# Altium schematic sheet BV100011_ControlDO.SchDoc
size A3
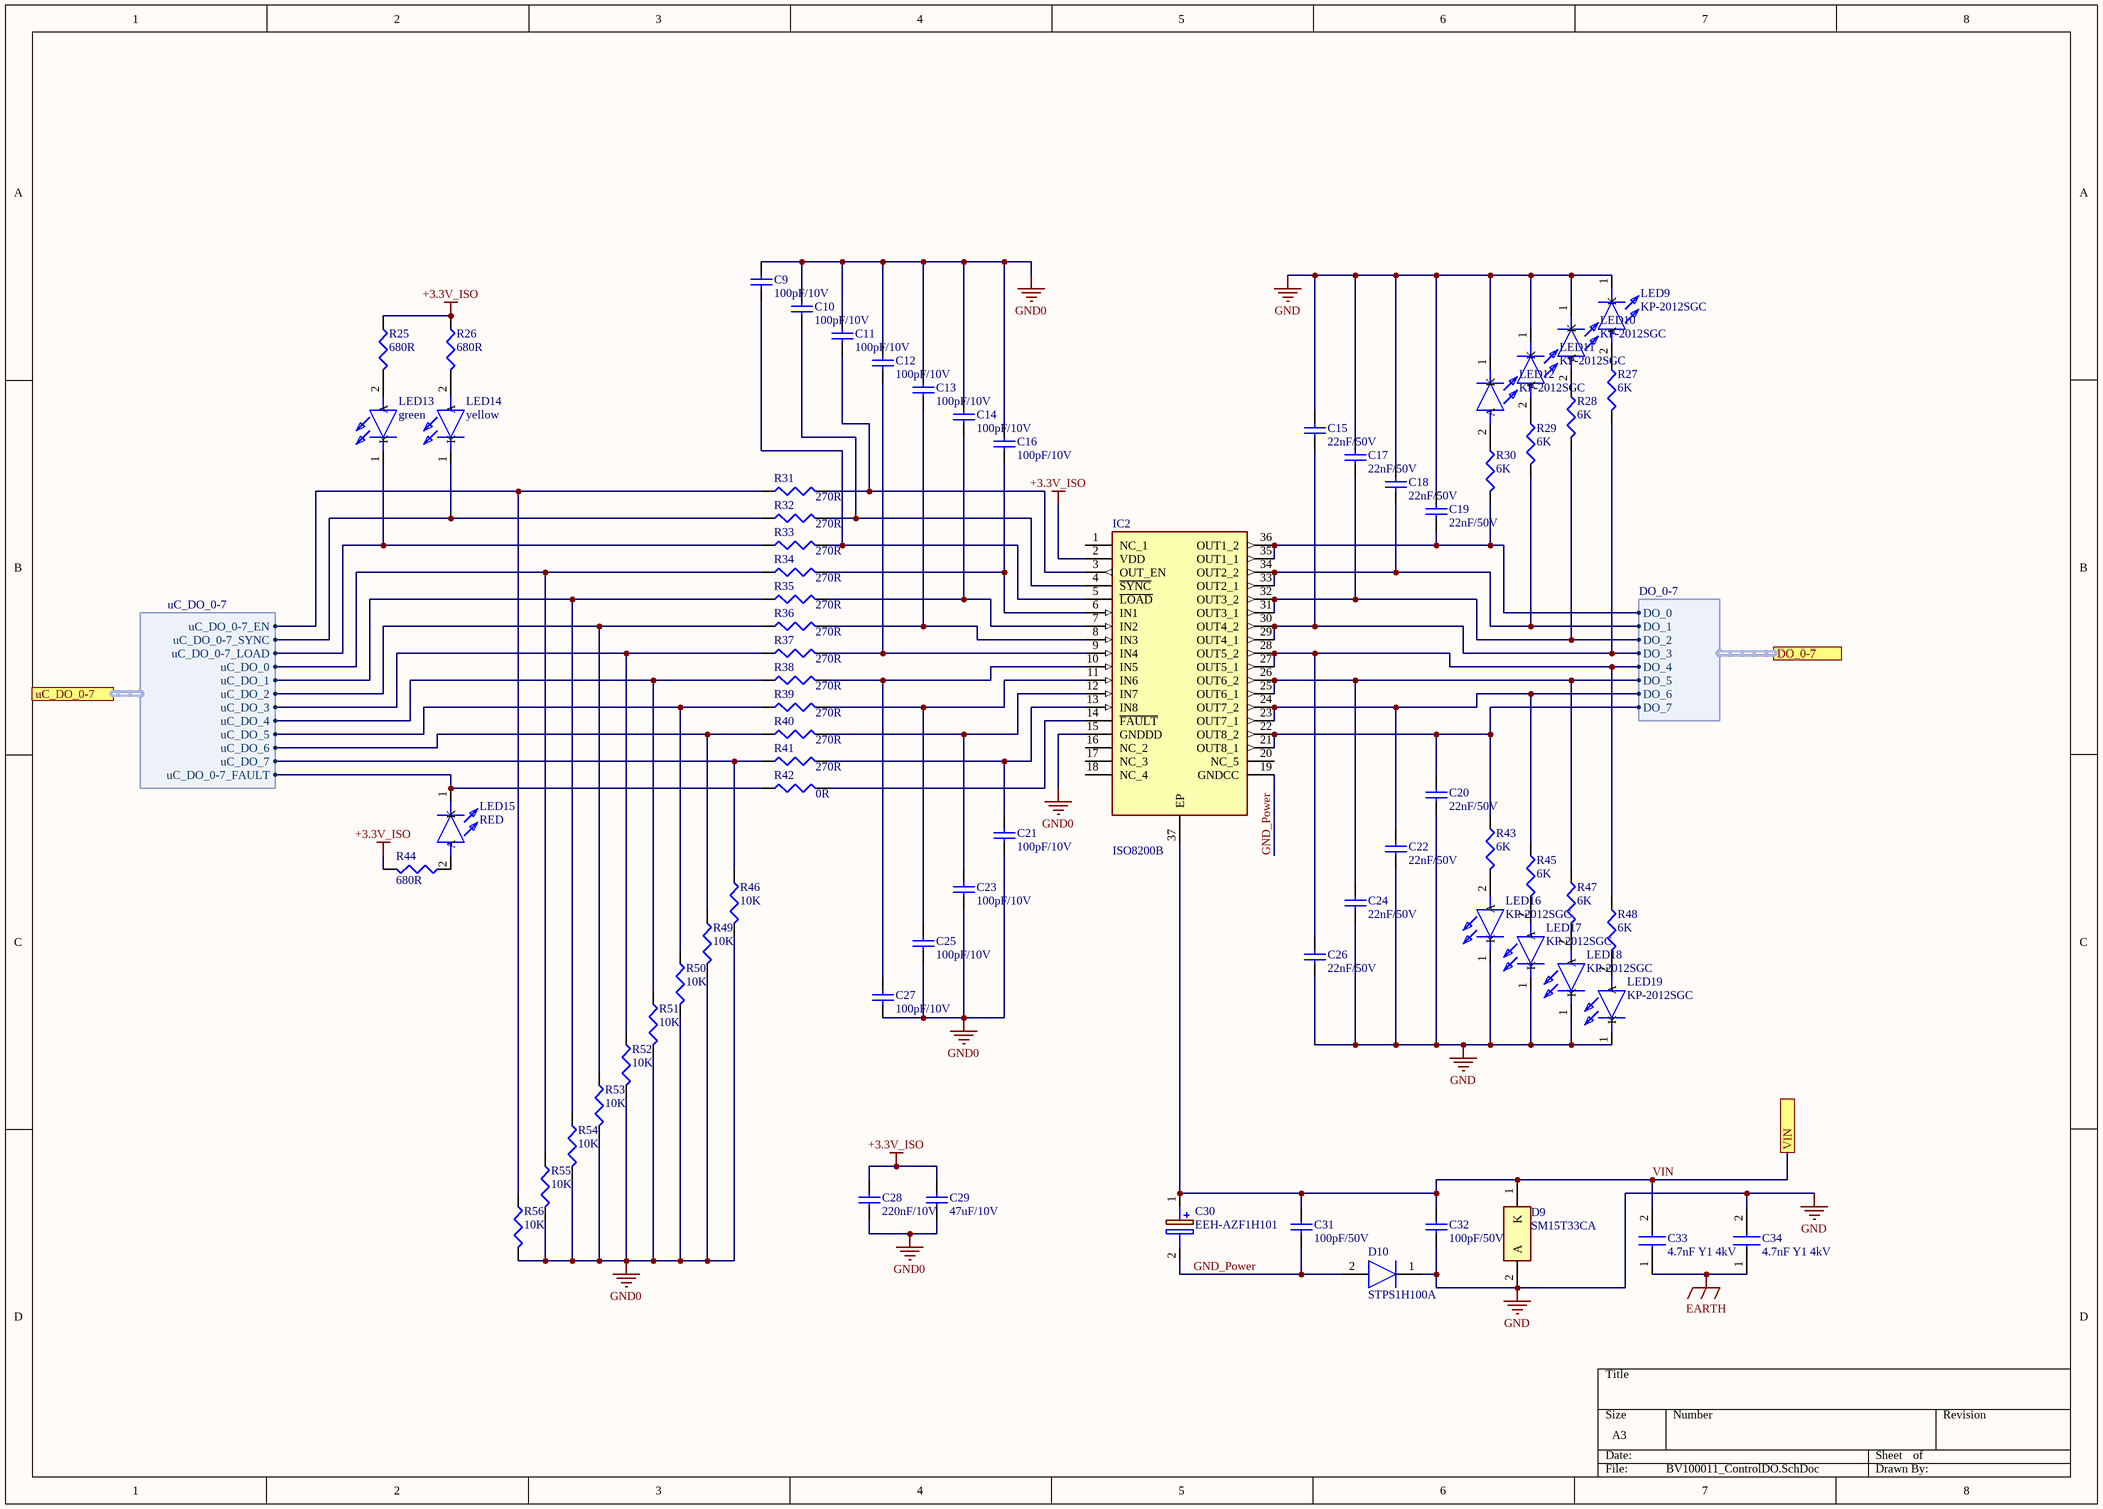
[diagram p0: BV100011_ControlDO.SchDoc]

## Parts
C9  100pF/10V  [0402]
C10  100pF/10V  [0402]
C11  100pF/10V  [0402]
C12  100pF/10V  [0402]
C13  100pF/10V  [0402]
C14  100pF/10V  [0402]
C15  22nF/50V  [C1210]
C16  100pF/10V  [0402]
C17  22nF/50V  [C1210]
C18  22nF/50V  [C1210]
C19  22nF/50V  [C1210]
C20  22nF/50V  [C1210]
C21  100pF/10V  [0402]
C22  22nF/50V  [C1210]
C23  100pF/10V  [0402]
C24  22nF/50V  [C1210]
C25  100pF/10V  [0402]
C26  22nF/50V  [C1210]
C27  100pF/10V  [0402]
C28  220nF/10V  [C1210]
C29  47uF/10V  [C1210]
C30  EEH-AZF1H101  [CAPPRD500W65D1000H1050]
C31  100pF/50V  [C1210]
C32  100pF/50V  [C1210]
C33  4.7nF Y1 4kV  [VY1472M63Y5UQ63V0]
C34  4.7nF Y1 4kV  [VY1472M63Y5UQ63V0]
D9  SM15T33CA  [DIONM8059X265N]
D10  STPS1H100A  [DIOM5126X265N]
IC2  ISO8200B  [SOP65P1420X360-37N]
LED9  KP-2012SGC  [LEDC2012X110N]
LED10  KP-2012SGC  [LEDC2012X110N]
LED11  KP-2012SGC  [LEDC2012X110N]
LED12  KP-2012SGC  [LEDC2012X110N]
LED13  green  [LEDC2012X110N]
LED14  yellow  [LEDC2012X110N]
LED15  RED  [LEDC2012X110N]
LED16  KP-2012SGC  [LEDC2012X110N]
LED17  KP-2012SGC  [LEDC2012X110N]
LED18  KP-2012SGC  [LEDC2012X110N]
LED19  KP-2012SGC  [LEDC2012X110N]
R25  680R  [0402]
R26  680R  [0402]
R27  6K  [0805R]
R28  6K  [0805R]
R29  6K  [0805R]
R30  6K  [0805R]
R31  270R  [0402]
R32  270R  [0402]
R33  270R  [0402]
R34  270R  [0402]
R35  270R  [0402]
R36  270R  [0402]
R37  270R  [0402]
R38  270R  [0402]
R39  270R  [0402]
R40  270R  [0402]
R41  270R  [0402]
R42  0R  [0402]
R43  6K  [0805R]
R44  680R  [0402]
R45  6K  [0805R]
R46  10K  [0402]
R47  6K  [0805R]
R48  6K  [0805R]
R49  10K  [0402]
R50  10K  [0402]
R51  10K  [0402]
R52  10K  [0402]
R53  10K  [0402]
R54  10K  [0402]
R55  10K  [0402]
R56  10K  [0402]

## Ports
DO_0-7 (harness DO_0-7), uC_DO_0-7 (harness uC_DO_0-7), VIN

## Harnesses
DO_0-7: DO_0, DO_1, DO_2, DO_3, DO_4, DO_5, DO_6, DO_7
uC_DO_0-7: uC_DO_0-7_EN, uC_DO_0-7_SYNC, uC_DO_0-7_LOAD, uC_DO_0, uC_DO_1, uC_DO_2, uC_DO_3, uC_DO_4, uC_DO_5, uC_DO_6, uC_DO_7, uC_DO_0-7_FAULT

## Nets
+3.3V_ISO: C28.2 C29.2 IC2.2(VDD) R25.1 R26.1 R44.2
EARTH: C33.1 C34.1
GND: C15.1 C17.1 C18.1 C19.1 C20.2 C22.2 C24.2 C26.2 C32.1 C34.2 D9.2(A) D10.1(K) LED9.1(K) LED10.1(K) LED11.1(K) LED12.1(K) LED16.1(K) LED17.1(K) LED18.1(K) LED19.1(K)
GND0: C9.1 C10.1 C11.1 C12.1 C13.1 C14.1 C16.1 C21.2 C23.2 C25.2 C27.2 C28.1 C29.1 IC2.15(GNDDD) R46.2 R49.2 R50.2 R51.2 R52.2 R53.2 R54.2 R55.2 R56.2
GND_Power: C30.2(-) C31.1 D10.2(A) IC2.19(GNDCC)
VIN: C30.1(+) C31.2 C32.2 C33.2 D9.1(K) IC2.37(EP) ; port VIN
NetC9_2: C9.2 IC2.5(~{LOAD}) R33.2
NetC10_2: C10.2 IC2.4(~{SYNC}) R32.2
NetC11_2: C11.2 IC2.3(OUT_EN) R31.2
NetC12_2: C12.2 IC2.9(IN4) R37.2
NetC13_2: C13.2 IC2.8(IN3) R36.2
NetC14_2: C14.2 IC2.7(IN2) R35.2
NetC15_2: C15.2 IC2.29(OUT4_1) IC2.30(OUT4_2) R27.2 ; port DO_0-7.DO_3
NetC16_2: C16.2 IC2.6(IN1) R34.2
NetC17_2: C17.2 IC2.31(OUT3_1) IC2.32(OUT3_2) R28.2 ; port DO_0-7.DO_2
NetC18_2: C18.2 IC2.33(OUT2_1) IC2.34(OUT2_2) R29.2 ; port DO_0-7.DO_1
NetC19_2: C19.2 IC2.35(OUT1_1) IC2.36(OUT1_2) R30.2 ; port DO_0-7.DO_0
NetC20_1: C20.1 IC2.21(OUT8_1) IC2.22(OUT8_2) R43.1 ; port DO_0-7.DO_7
NetC21_1: C21.1 IC2.13(IN8) R41.2
NetC22_1: C22.1 IC2.23(OUT7_1) IC2.24(OUT7_2) R45.1 ; port DO_0-7.DO_6
NetC23_1: C23.1 IC2.12(IN7) R40.2
NetC24_1: C24.1 IC2.25(OUT6_1) IC2.26(OUT6_2) R47.1 ; port DO_0-7.DO_5
NetC25_1: C25.1 IC2.11(IN6) R39.2
NetC26_1: C26.1 IC2.27(OUT5_1) IC2.28(OUT5_2) R48.1 ; port DO_0-7.DO_4
NetC27_1: C27.1 IC2.10(IN5) R38.2
NetIC2_14: IC2.14(~{FAULT}) R42.2
NetLED9_2: LED9.2(A) R27.1
NetLED10_2: LED10.2(A) R28.1
NetLED11_2: LED11.2(A) R29.1
NetLED12_2: LED12.2(A) R30.1
NetLED13_1: LED13.1(K) R33.1 ; port uC_DO_0-7.uC_DO_0-7_LOAD
NetLED13_2: LED13.2(A) R25.2
NetLED14_1: LED14.1(K) R32.1 ; port uC_DO_0-7.uC_DO_0-7_SYNC
NetLED14_2: LED14.2(A) R26.2
NetLED15_1: LED15.1(K) R42.1 ; port uC_DO_0-7.uC_DO_0-7_FAULT
NetLED15_2: LED15.2(A) R44.1
NetLED16_2: LED16.2(A) R43.2
NetLED17_2: LED17.2(A) R45.2
NetLED18_2: LED18.2(A) R47.2
NetLED19_2: LED19.2(A) R48.2
NetR31_1: R31.1 R56.1 ; port uC_DO_0-7.uC_DO_0-7_EN
NetR34_1: R34.1 R55.1 ; port uC_DO_0-7.uC_DO_0
NetR35_1: R35.1 R54.1 ; port uC_DO_0-7.uC_DO_1
NetR36_1: R36.1 R53.1 ; port uC_DO_0-7.uC_DO_2
NetR37_1: R37.1 R52.1 ; port uC_DO_0-7.uC_DO_3
NetR38_1: R38.1 R51.1 ; port uC_DO_0-7.uC_DO_4
NetR39_1: R39.1 R50.1 ; port uC_DO_0-7.uC_DO_5
NetR40_1: R40.1 R49.1 ; port uC_DO_0-7.uC_DO_6
NetR41_1: R41.1 R46.1 ; port uC_DO_0-7.uC_DO_7

Not connected (* = marked no-connect by the designer): IC2 1(NC_1) 16(NC_2) 17(NC_3) 18(NC_4) 20(NC_5)

## Library data of the parts
C9-C29 C31 C32 = Cap Semi: Capacitor (Semiconductor SIM Model); Published: 8-Jun-2000; LatestRevisionDate: 29-May-2009; LatestRevisionNote: IPC-7351 Footprint Added.; PackageReference: C1206; Publisher: Altium Limited; PackageDescription: Chip Capacitor
  C9-C14 C16 C21 C23 C25 C27: Value: 100pF/10V
  C15 C17-C20 C22 C24 C26: Value: 22nF/50V
  C28: Value: 220nF/10V
  C29: Value: 47uF/10V
  C31 C32: Value: 100pF/50V
C30 = EEH-AZF1H101: Capacitor Polarised; Manufacturer_Name: Panasonic; Datasheet Link: https://componentsearchengine.com/Datasheets/1/EEH-AZF1H101.pdf; Height: 10.5mm; Manufacturer_Part_Number: EEH-AZF1H101; Mouser Part Number: 667-EEH-AZF1H101; Mouser Price/Stock: https://www.mouser.com/Search/Refine.aspx?Keyword=667-EEH-AZF1H101
C33 C34 = VY1472M63Y5UQ63V0: Capacitor; Manufacturer_Name: VISHAY BC COMPONENTS; Allied_Number: 70122998; Datasheet Link: http://www.vishay.com/docs/28537/vy1series.pdf; Height: 19mm; Manufacturer_Part_Number: VY1472M63Y5UQ63V0; Allied Price/Stock: https://www.alliedelec.com/bccomponents-vishay-vy1472m63y5uq63v0/70122998/
D9 = SM15T33CA: Diode; Manufacturer_Name: STMicroelectronics; Allied_Number: 70390412; Datasheet Link: http://www.st.com/web/en/resource/technical/document/datasheet/CD00000724.pdf; Height: 2.65mm; Manufacturer_Part_Number: SM15T33CA; Mouser Part Number: 511-SM15T33CA; Mouser Price/Stock: https://www.mouser.com/Search/Refine.aspx?Keyword=511-SM15T33CA; RS Part Number: 9196428; RS Price/Stock: https://uk.rs-online.com/web/p/products/9196428; Allied Price/Stock: http://www.alliedelec.com/stmicroelectronics-sm15t33ca/70390412/
D10 = STPS1H100A: Diode; Manufacturer_Name: STMicroelectronics; Allied_Number: 70014065; Datasheet Link: http://www.st.com/web/en/resource/technical/document/datasheet/CD00001304.pdf; Height: 2.65mm; Manufacturer_Part_Number: STPS1H100A; Mouser Part Number: 511-STPS1H100A; Mouser Price/Stock: https://www.mouser.com/Search/Refine.aspx?Keyword=511-STPS1H100A; RS Part Number: 0249892P; RS Price/Stock: http://uk.rs-online.com/web/p/products/0249892P; Allied Price/Stock: http://www.alliedelec.com/stmicroelectronics-stps1h100a/70014065/
IC2 = ISO8200B: Integrated Circuit; Manufacturer_Name: STMicroelectronics; Datasheet Link: https://componentsearchengine.com/Datasheets/1/ISO8200B.pdf; Height: 3.6mm; Mouser Part Number: 511-ISO8200B; Mouser Price/Stock: https://www.mouser.com/Search/Refine.aspx?Keyword=511-ISO8200B; Manufacturer_Part_Number: ISO8200B
LED9-LED19 = KP-2012SGC: LED; Manufacturer_Name: Kingbright; Datasheet Link: http://my.rs-online.com/webdocs/032f/0900766b8032fa8b.pdf; Height: 1.1mm; Manufacturer_Part_Number: KP-2012SGC; Mouser Part Number: N/A; Mouser Price/Stock: https://www.mouser.com/Search/Refine.aspx?Keyword=N%2FA; RS Part Number: 4663807; RS Price/Stock: https://uk.rs-online.com/web/p/products/4663807
R25-R56 = Res3: Resistor; Published: 8-Jun-2000; LatestRevisionDate: 29-May-2009; LatestRevisionNote: IPC-7351 Footprint Added.; PackageReference: J1-0603; Publisher: Altium Limited; PackageDescription: Chip Resistor
  R25 R26 R44: Value: 680R
  R27-R30 R43 R45 R47 R48: Value: 6K
  R31-R41: Value: 270R
  R42: Value: 0R
  R46 R49-R56: Value: 10K